# EAGLE design AQETHBluePill_w_RESET (EAGLE 6.5.0)
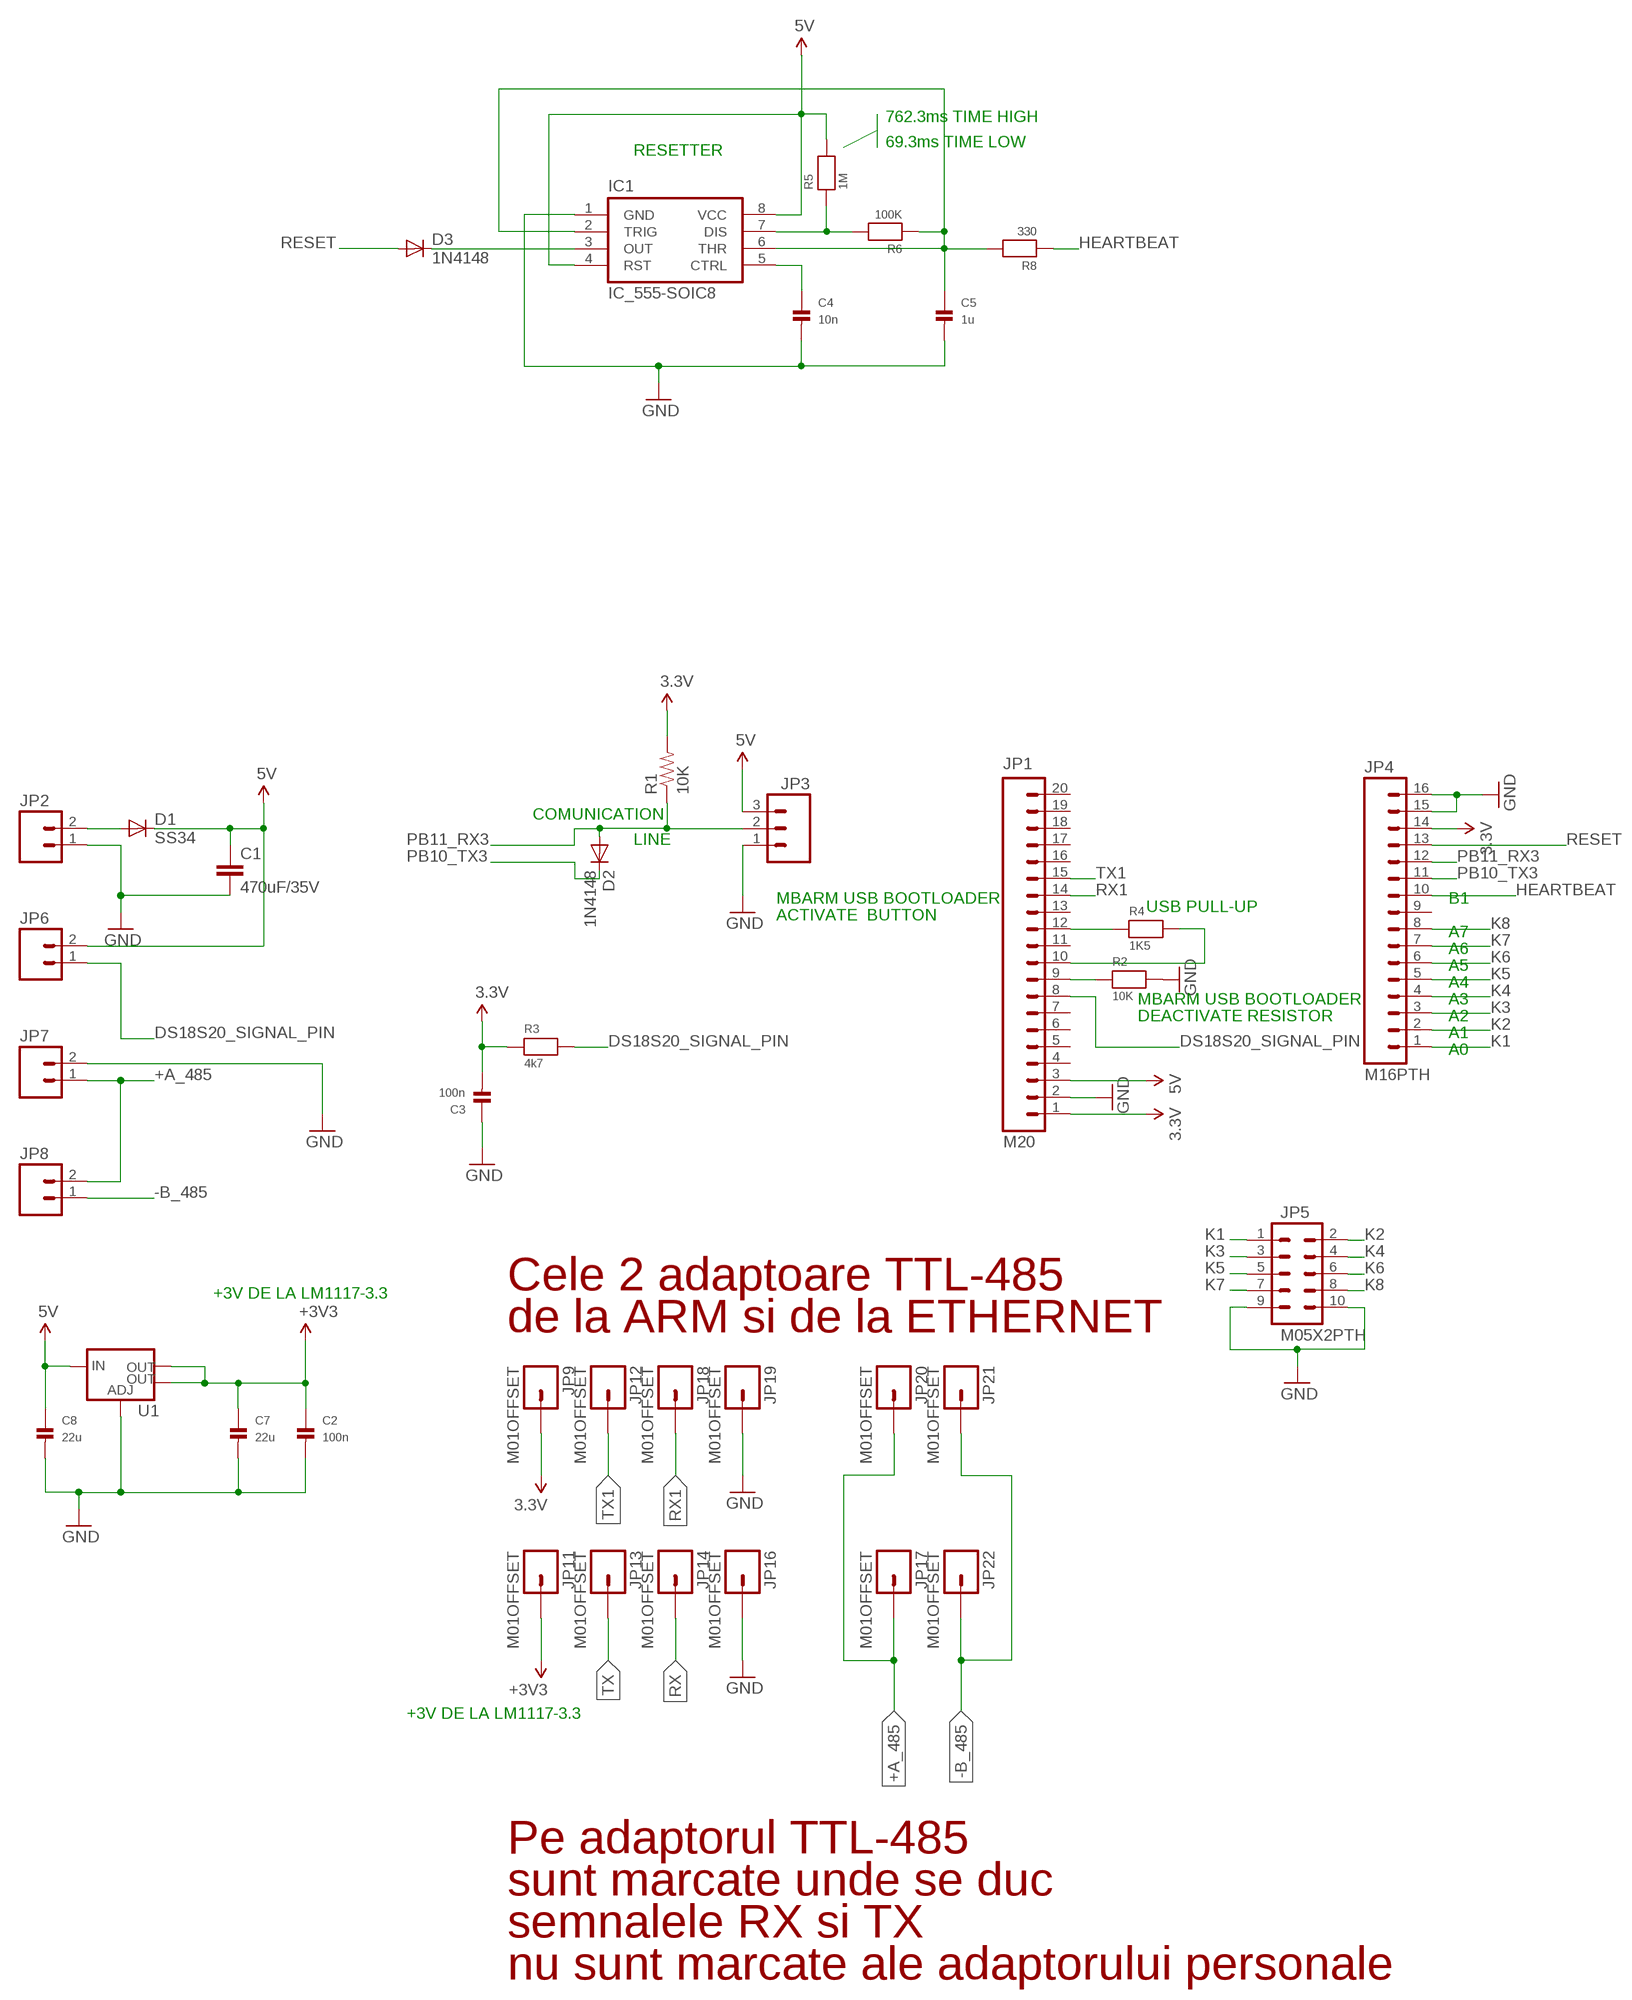
[diagram p0: schematic, sheet 1]

## Parts
C1  470uF/35V  CAPPTH1  [CAP-PTH-5MM]
C2  100n  CAP_CERAMIC_0805MP  [_0805MP]
C3  100n  CAP_CERAMIC_0805MP  [_0805MP]
C4  10n  CAP_CERAMIC_0805MP  [_0805MP]
C5  1u  CAP_CERAMIC1206  [1206]
C7  22u  CAP_CERAMIC1206  [1206]
C8  22u  CAP_CERAMIC1206  [1206]
D1  SS34  DIODE-SMC  [SMC]
D2  1N4148  DIODE-MINIMELF  [MINIMELF]
D3  1N4148  DIODE-MINIMELF  [MINIMELF]
IC1  IC_555-SOIC8  [SOIC-8]
JP1  M20  [1X20]
JP2  M025MM  [SCREWTERMINAL-5MM-2]
JP3  M03LOCK_LONGPADS  [1X03_LOCK_LONGPADS]
JP4  M16PTH  [1X16]
JP5  M05X2PTH  [AVR_ICSP]
JP6  M025MM  [SCREWTERMINAL-5MM-2]
JP7  M025MM  [SCREWTERMINAL-5MM-2]
JP8  M025MM  [SCREWTERMINAL-5MM-2]
JP9  M01OFFSET  [1X01_OFFSET]
JP11  M01OFFSET  [1X01_OFFSET]
JP12  M01OFFSET  [1X01_OFFSET]
JP13  M01OFFSET  [1X01_OFFSET]
JP14  M01OFFSET  [1X01_OFFSET]
JP16  M01OFFSET  [1X01_OFFSET]
JP17  M01OFFSET  [1X01_OFFSET]
JP18  M01OFFSET  [1X01_OFFSET]
JP19  M01OFFSET  [1X01_OFFSET]
JP20  M01OFFSET  [1X01_OFFSET]
JP21  M01OFFSET  [1X01_OFFSET]
JP22  M01OFFSET  [1X01_OFFSET]
R1  10K  RESISTOR1206  [1206]
R2  10K  RESISTOR_0805MP  [_0805MP]
R3  4k7  RESISTOR_0805MP  [_0805MP]
R4  1K5  RESISTOR_0805MP  [_0805MP]
R5  1M  RESISTOR_0805MP  [_0805MP]
R6  100K  RESISTOR_0805MP  [_0805MP]
R8  330  RESISTOR_0805MP  [_0805MP]
U1  V_REG_LM1117SOT223  [SOT223]

## Nets
3.3V: C3.2 JP1.1 JP4.14 JP9.1 R1.2 R3.1
5V: C1.1 C8.1 D1.C IC1.4(RST) IC1.8(VCC) JP1.3 JP3.3 JP6.2 R5.2 U1.3(IN)
+A_485: JP7.1 JP8.2 JP17.1 JP20.1
-B_485: JP8.1 JP21.1 JP22.1
CTRL: C4.1 IC1.5(CTRL)
DS18S20_SIGNAL_PIN: JP1.8 JP6.1 R3.2
GND: C1.2 C2.2 C3.1 C4.2 C5.2 C7.2 C8.2 IC1.1(GND) JP1.2 JP2.1 JP3.1 JP4.15 JP4.16 JP5.9 JP5.10 JP7.2 JP16.1 JP19.1 R2.2 U1.1(ADJ)
HEARTBEAT: JP4.10 R8.1
K1: JP4.1 JP5.1
K2: JP4.2 JP5.2
K3: JP4.3 JP5.3
K4: JP4.4 JP5.4
K5: JP4.5 JP5.5
K6: JP4.6 JP5.6
K7: JP4.7 JP5.7
K8: JP4.8 JP5.8
N$1: JP1.10 R4.2
N$2: JP1.9 R2.1
N$3: JP1.12 R4.1
N$6: C5.1 IC1.2(TRIG) IC1.6(THR) R6.1 R8.2
N$7: D3.C IC1.3(OUT)
N$8: IC1.7(DIS) R5.1 R6.2
N$12: D1.A JP2.2
PB10_TX3: D2.C JP4.11
PB11_RX3: D2.A JP3.2 JP4.12 R1.1
RESET: D3.A JP4.13
RX: JP14.1
RX1: JP1.14 JP18.1
TX: JP13.1
TX1: JP1.15 JP12.1
VCC: C2.1 C7.1 JP11.1 U1.2(OUT) U1.4(OUT) ; supply symbol labelled +3V3
Unconnected: JP1.4 JP1.5 JP1.6 JP1.7 JP1.11 JP1.13 JP1.16 JP1.17 JP1.18 JP1.19 JP1.20 JP4.9

## Notes on the sheet
- 762.3ms TIME HIGH
- 69.3ms TIME LOW
- RESETTER
- COMUNICATION
- LINE
- MBARM USB BOOTLOADER | B1
- USB PULL-UP
- ACTIVATE  BUTTON
- A7
- A6
- A5
- A4
- MBARM USB BOOTLOADER | A3
- DEACTIVATE RESISTOR | A2
- A1
- A0
- Cele 2 adaptoare TTL-485
- +3V DE LA LM1117-3.3
- de la ARM si de la ETHERNET
- +3V DE LA LM1117-3.3
- Pe adaptorul TTL-485
- sunt marcate unde se duc
- semnalele RX si TX
- nu sunt marcate ale adaptorului personale

## Library data of the parts
C1 = SparkFun-Passives:CAP: Capacitor Standard 0603 ceramic capacitor, and 0.1" leaded capacitor.
C2-C5 C7 C8 = microbuilder:CAP_CERAMIC: Ceramic Capacitors 0402 - 0402 Surface Mount Capacitors 16pF 50V 5% [Digikey: 445-4899-2-ND] 18pF 50V 5% [Digikey: 490-1281-2-ND] 22pF 50V 5% [Digikey: 490-1283-2-ND] 68pF 50V 5% [Digikey: 490-1289-2-ND] 0.1uF 10V 10% [Digikey: 490-1318-2-ND] 1.0uF 6.3V 10% [Digikey: 490-1320-2-ND] 0603 - 0603 Surface Mount Capacitors 16 pF 50V 5% [Digikey: 445-5051-2-ND] 22 pF 50V [Digikey: PCC220ACVTR-ND] 33 pF 50V 5% [Digikey: 490-1415-1-ND] 56pF 50V 5% [Digikey: 490-1421-1-ND] 220pF 50V 5% [Digikey: 445-1285-1-ND] 680 pF 50V 2200 pF 50V 5% C0G [Digikey: 445-1297-1-ND] 5600 pF 100V 5% X7R [Digikey: 478-3711-1-ND] 0.1 µF 25V 10% [Digikey: PCC2277TR-ND] 0.22 µF 16V 10% X7R [Digikey: 445-1318-1-ND] 1.0 µF 25V 10% [Digikey: 445-5146-2-ND] 0603 - RF Specific 3pF 250V +/-0.1pF RF [Digikey: 712-1347-1-ND] 18 pF 250V 5% [Digikey: 478-3505-1-ND or 712-1322-1-ND] 56 pF 250V 5% C0G RF [Digikey: 490-4867-1-ND] 68 pF 250V RF [Digikey: 490-4868-1-ND] 0805 - 0805 Surface Mount Capacitors 220 pF 250V 2% RF Ceramic Capacitor [Digikey: 712-1398-1-ND] 1000 pF 50V 2% NP0 Ceramic Capacitor [Digikey: 478-3760-1-ND] 0.1 µF 25V 10% Ceramic Capacitor [Digikey: PCC1828TR-ND] 1.0 µF 16V 10% Ceramic Capacitor[Digikey: 490-1691-2-ND] 10.0 µF 10V 10% Ceramic Capacitor[Digikey: 709-1228-1-ND] 10.0 uF 16V 10% Ceramic Capacitor [Digikey: 478-5165-2-ND] 47 uF 6.3V 20% Ceramic Capacitor [Digikey: 587-1779-1-ND or 399-5506-1-ND] 1206 - 1206 Surface Mount Capacitors 47uF 10V 20% Ceramic Capacitor [Digikey: 490-5528-1-ND or 399-5508-1-ND or 445-6010-1-ND] 100uF 6.3V -20%, +80% Y5V Ceramic Capacitor (Digikey: 490-4512-1-ND, Mouser: 81-GRM31CF50J107ZE1L)
D1-D3 = diode:DIODE-: DIODE
IC1 = dp_devices:IC_555: Classic 555 IC
JP1 = SparkFun-Connectors:M20: 1x20 .1" header This is just like the LOCK variant in that the holes are staggared by 5 mil, but except for the last two holes. They are not altered from the "standard" footprint layout. This is used for a special purpose on the layout of our Graphic LCD Backpack. Make sure you want to use this device before selecting it for you project!
JP2 JP6-JP8 = SparkFun-Connectors:M02: Header 2 Standard 2-pin 0.1" header. Use with straight break away headers (SKU : PRT-00116), right angle break away headers (PRT-00553), swiss pins (PRT-00743), machine pins (PRT-00117), and female headers (PRT-00115). Molex polarized connector foot print use with SKU : PRT-08233 with associated crimp pins and housings.
JP3 = SparkFun-Connectors:M03: Header 3 Standard 3-pin 0.1" header. Use with straight break away headers (SKU : PRT-00116), right angle break away headers (PRT-00553), swiss pins (PRT-00743), machine pins (PRT-00117), and female headers (PRT-00115). Molex polarized connector foot print use with SKU : PRT-08232 with associated crimp pins and housings.
JP4 = SparkFun-Connectors:M16: 1x16 .1" header
JP5 = SparkFun-Connectors:M05X2: Header 5x2 Standard 10-pin dual row 0.1" header. Commonly used with AVR-ISP. Use with Spark Fun Electronics SKU: PRT-00778
JP9 JP11-JP14 JP16-JP22 = SparkFun-Connectors:M01: Header 1 Standard 1-pin 0.1" header. Use with straight break away headers (SKU : PRT-00116), right angle break away headers (PRT-00553), swiss pins (PRT-00743), machine pins (PRT-00117), and female headers (PRT-00115).
R1 = SparkFun-Passives:RESISTOR: Resistor Basic schematic elements and footprints for 0603, 1206, and PTH resistors.
R2-R6 R8 = microbuilder:RESISTOR: Resistors 0402 - 0402 Surface Mount Package 22 Ohm 1% 1/16W [Digikey: 311-22.0LRTR-ND] 33 Ohm 5% 1/16W 1.0K 5% 1/16W 1.5K 5% 1/16W 2.0K 1% 1/16W 10.0K 1% 1/16W [Digikey: 311-10.0KLRTR-ND] 10.0K 5% 1/16W [Digikey: RMCF0402JT10K0TR-ND] 12.1K 1% 1/16W [Digikey: 311-22.0LRTR-ND] 100.0K 5% 1/16W 0603 - 0603 Surface Mount Package 0 Ohm 1/10 Watt 1% Resistor 15 Ohm 1/10 Watt 1% Resistor 33 Ohm 1/10 Watt 1% Resistor 49.9 Ohm 1/10 Watt 1% Resistor 100 Ohm 1/10 Watt 1% Resistor 150 Ohm 1/10 Watt 1% Resistor 240 Ohm 1/10 Watt 1% Resistor 390 Ohm 1/10 Watt 1% Resistor 560 Ohm 1/10 Watt 1% Resistor 680 Ohm 1/10 Watt 1% Resistor 750 Ohm 1/10 Watt 1% Resistor 1.0K Ohm 1/10 Watt 1% Resistor 1.5K Ohm 1/10 Watt 1% Resistor 2.0K Ohm 1/10 Watt 1% Resistor 2.2K Ohm 1/10 Watt 1% Resistor 3.3K Ohm 1/10 Watt 1% Resistor 4.7K Ohm 1/10 Watt 1% Resistor 10.0K Ohm 1/10 Watt 1% Resistor 12.0K Ohm 1/10 Watt 1% Resistor 12.1K Ohm 1/10 Watt 1% Resistor 20.0K Ohm 1/10 Watt 1% Resistor 33.0K Ohm 1/10 Watt 1% Resistor 100.0K Ohm 1/10 Watt 1% Resistor 0805 - 0805 Surface Mount Package 0 Ohm 1/8 Watt 1% Resistor 33 Ohm 1/8 Watt 1% Resistor 100 Ohm 1/8 Watt 1% Resistor 150 Ohm 1/8 Watt 1% Resistor 200 Ohm 1/8 Watt 1% Resistor 240 Ohm 1/8 Watt 1% Resistor 330 Ohm 1/8 Watt 1% Resistor 390 Ohm 1/8 Watt 1% Resistor 470 Ohm 1/8 Watt 1% Resistor 1.0K Ohm 1/8 Watt 1% Resistor 1.5K Ohm 1/8 Watt 1% Resistor 2.0K Ohm 1/8 Watt 1% Resistor 4.7K Ohm 1/8 Watt 1% Resistor 5.1K Ohm 1/8 Watt 1% Resistor 5.6K Ohm 1/8 Watt 1% Resistor 10.0K Ohm 1/8 Watt 1% Resistor 22.0K Ohm 1/8 Watt 1% Resistor 33.0K Ohm 1/8 Watt 1% Resistor 100K Ohm 1/8 Watt 1% Resistor 1206 - 1206 Surface Mount Package 2012 - 2010 Surface Mount Package 0.11 Ohm 1/2 Watt 1% Resistor - Digikey: RHM.11UCT-ND
U1 = SparkFun-PowerIC:V_REG_LM1117: Voltage Regulator LM1117 Standard adjustable voltage regulator but in SMD form. Spark Fun Electronics SKU : COM-00595; PROD_ID: VREG-08170

## Board
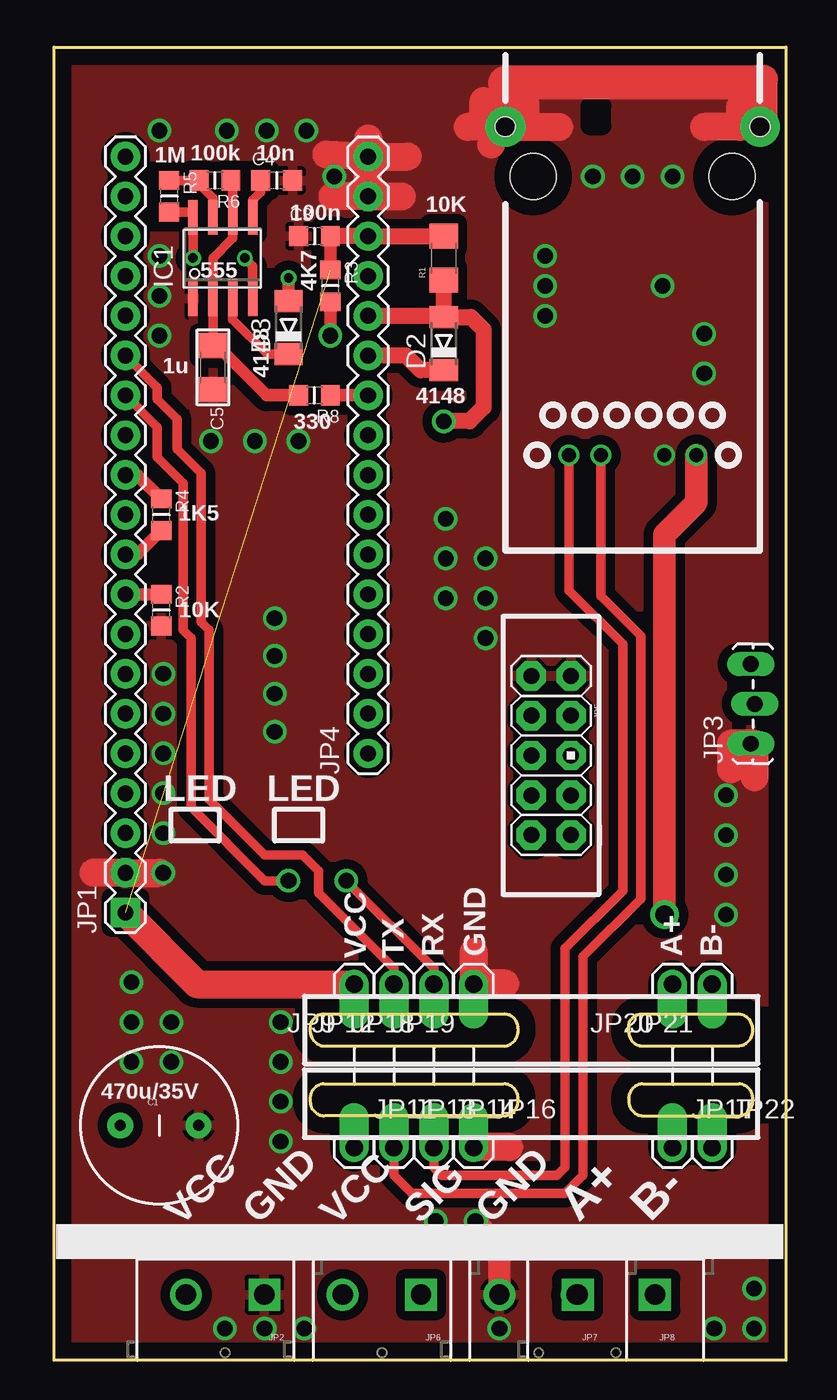
[diagram p1: board, top side]
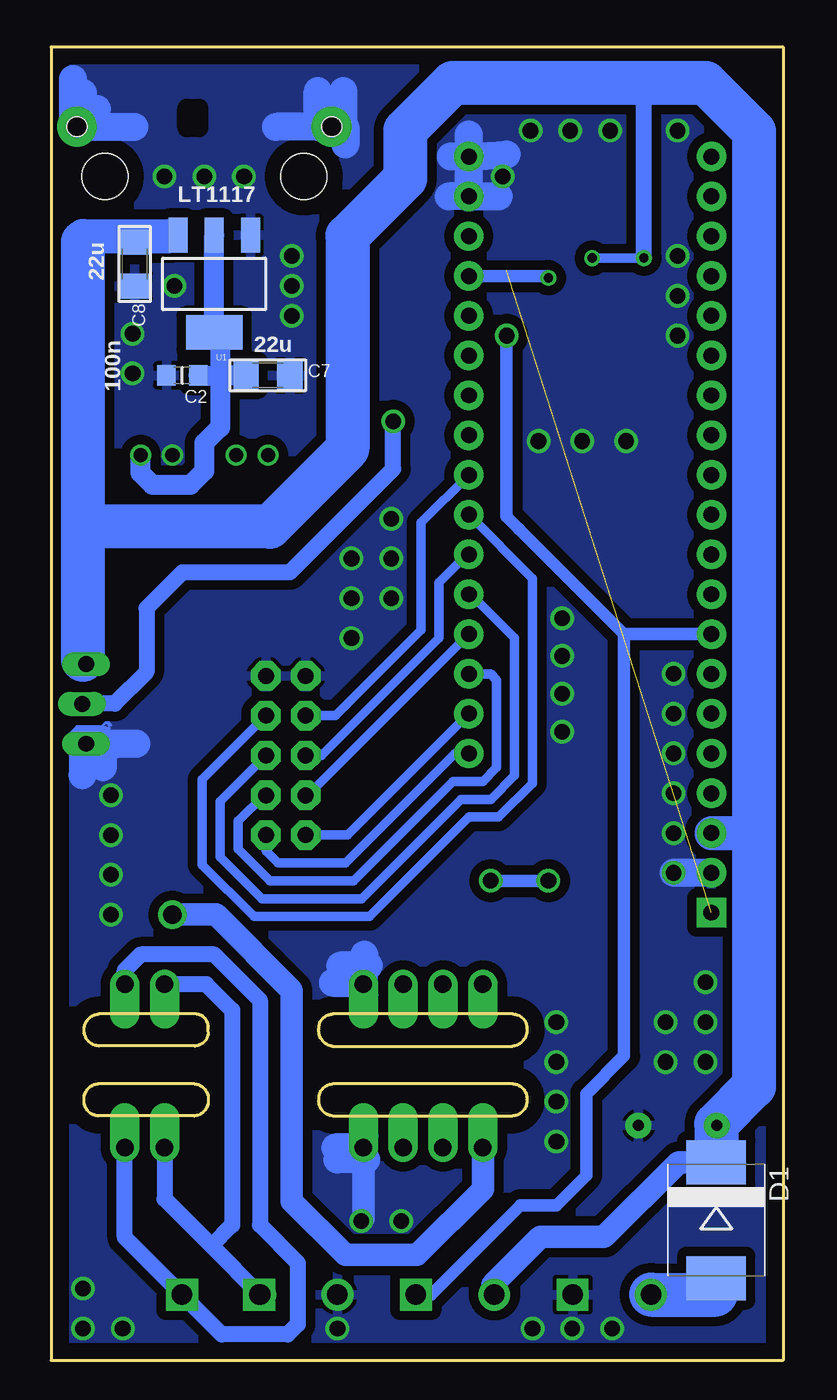
[diagram p2: board, bottom side, seen from below]

Size 46.74 x 83.82 mm. Coordinates in mm from the lower left corner, seen from the top.
Outline: 37.59,15.6 43.74,15.6 arc90 44.63,16.64 arc90 43.74,17.65 37.59,17.65 arc90 36.7,16.64 arc90 37.62,15.6
Outline: 46.74,83.82 46.74,0 0,0 0,83.82 46.74,83.82
Outline: 17.25,17.65 28.75,17.65 arc-90 29.64,16.64 arc-90 28.75,15.6 17.27,15.6 arc-90 16.36,16.64 arc-90 17.25,17.65
Outline: 37.47,22.1 43.69,22.1 arc-90 44.63,21.08 arc-90 43.69,20.07 37.59,20.07 arc-90 36.7,20.95 36.7,21.21 arc-90 37.47,22.1
Outline: 17.25,22.1 28.75,22.1 arc-90 29.64,21.21 arc-90 28.75,20.04 17.27,20.04 arc-90 16.36,21.21 arc-90 17.25,22.1
Copper layers (1*16): Top 0.035mm / dielectric 1.5mm / Bottom 0.035mm
Design rules "default *": minimum track width 10mil, minimum drill 24mil, track to track 8mil, track to pad 8mil, pad to pad 8mil, via to via 8mil, smd to smd 8mil, copper to edge 40mil, drill to drill 8mil, minimum pad ring 10mil, minimum via ring 8mil, stop-mask expansion 4mil, vias tented up to drill 24mil, thermal gap 10mil
Holes 1.27 mm at 45.09,78.74 28.83,78.74
Holes 2.92 mm at 30.61,75.56 43.31,75.56
tRestrict: area 34.2,78.8 to 35,80.1
bRestrict: area 37.3,78.7 to 38.1,79.9

### Footprints (pad centres in the part's own frame; a part is rotated, then mirrored left to right if it is on the bottom)
CAP-PTH-5MM = drill 0.7 pad 1.651: 1 -2.5,0; 2 2.5,0
_0805MP = smd 1.2 x 1.3: 1 -1.016,0; 2 1.016,0
1206 = smd 1.6 x 1.8: 1 -1.4,0; 2 1.4,0
SMC = smd 2.8 x 3.8: A 3.7,0; C -3.7,0
MINIMELF = smd 1.4 x 1.8: A 1.7,0; C -1.7,0
SOIC-8 = smd 0.6 x 2.2: 1 -1.905,-2.6; 2 -0.635,-2.6; 3 0.635,-2.6; 4 1.905,-2.6; 5 1.905,2.6; 6 0.635,2.6; 7 -0.635,2.6; 8 -1.905,2.6
1X20 = drill 1.016 pad 1.88 square: 1 0,0 | drill 1.016 pad 1.88: 2 2.54,0; 3 5.08,0; 4 7.62,0; 5 10.16,0; 6 12.7,0; 7 15.24,0; 8 17.78,0; 9 20.32,0; 10 22.86,0; 11 25.4,0; 12 27.94,0; 13 30.48,0; 14 33.02,0; 15 35.56,0; 16 38.1,0; 17 40.64,0; 18 43.18,0; 19 45.72,0; 20 48.26,0
SCREWTERMINAL-5MM-2 = drill 1.3 pad 2.032 square: 1 0,0 | drill 1.3 pad 2.032: 2 5,0
1X03_LOCK_LONGPADS = drill 1.016 long: 1 0,0; 2 2.54,-0.254; 3 5.08,0
1X16 = drill 1.016 pad 1.88: 1 0,0; 2 2.54,0; 3 5.08,0; 4 7.62,0; 5 10.16,0; 6 12.7,0; 7 15.24,0; 8 17.78,0; 9 20.32,0; 10 22.86,0; 11 25.4,0; 12 27.94,0; 13 30.48,0; 14 33.02,0; 15 35.56,0; 16 38.1,0
AVR_ICSP = drill 1.016 pad 1.88 octagon: 1 -1.27,5.08; 2 1.27,5.08; 3 -1.27,2.54; 4 1.27,2.54; 5 -1.27,0; 6 1.27,0; 7 -1.27,-2.54; 8 1.27,-2.54; 9 -1.27,-5.08; 10 1.27,-5.08
1X01_OFFSET = drill 1.118 pad 1.88 offset: 1 0,0
SOT223 = smd 1.219 x 2.235: 1 -2.311,-3.099; 2 0,-3.099; 3 2.311,-3.099 | smd 3.6 x 2.2: 4 0,3.099

### Placement (x,y rotation side)
C1  6.73,14.99 0 top
C2  38.35,62.87 180 bottom
C3  16.64,71.75 0 top
C4  14.22,75.31 0 top
C5  10.16,63.37 270 top
C7  32.89,62.87 0 bottom
C8  41.4,69.98 270 bottom
D1  4.27,8.94 270 bottom
D2  24.89,64.9 90 top
D3  14.99,65.91 90 top
IC1  10.79,70.36 0 top
JP1  4.57,28.57 90 top
JP2  13.44,4.19 180 top
JP3  44.5,39.36 90 top
JP4  20.07,38.73 90 top
JP5  31.75,38.61 180 top
JP6  23.44,4.19 180 top
JP7  33.45,4.19 180 top
JP8  38.38,4.19 180 top
JP9  19.18,24 180 top
JP11  19.18,13.59 0 top
JP12  21.72,24 180 top
JP13  21.72,13.59 0 top
JP14  24.26,13.59 0 top
JP16  26.8,13.59 0 top
JP17  39.5,13.59 0 top
JP18  24.26,24 180 top
JP19  26.8,24 180 top
JP20  39.5,24 180 top
JP21  42.04,24 180 top
JP22  42.04,13.59 0 top
R1  24.89,70.36 90 top
R2  6.86,47.88 270 top
R3  17.65,68.58 270 top
R4  6.86,53.98 270 top
R5  7.37,74.3 270 top
R6  10.29,75.31 180 top
R8  16.64,61.59 180 top
U1  36.32,68.71 180 bottom

### Tracks (layer width: path | path; a pad name or v marks a point on that pad's centre or on a via)
3.3V  (1 unrouted)
  Top 0.813: C3.2 R3.1
  Top 1.016: R1.2 JP4.14 C3.2
  Top 1.778: JP9.1 9.14,24 JP1.1
5V  (via drill 0.6)
  Top 0.61: IC1.4 12.7,69.85 v12.19,70.36 | R5.2 8.89,73.28 IC1.8 v8.89,70.36
  Bottom 0.61: C8.1 38.63,71.38 U1.3 38.63,71.75 39.12,71.75 | v12.19,70.36 v8.89,70.36
  Bottom 0.813: JP3.3 44.7,44.44 44.7,44.7
  Bottom 1.016: v8.89,70.36 8.89,81.53 8.76,81.53
  Bottom 1.422: JP6.2 18.54,4.29 18.54,4.83 15.49,7.87 11.43,7.87 6.66,12.64 D1.C | C1.1 4.27,14.95 4.27,13.21
  Bottom 2.184: JP1.3 1.86,33.66 1.86,33.53 | 44.7,71.37 44.7,71.75 39.12,71.75
  Bottom 2.794: 44.7,71.37 44.7,53.21 | 44.7,53.21 44.7,44.7 | 44.7,53.21 32.77,53.21 27.81,58.17 27.81,71.75 24.13,75.44 24.13,78.49 21.08,81.53 8.76,81.53 4.95,81.53 1.86,78.44 1.86,33.53 1.86,17.49 4.27,15.08 4.27,13.21 D1.C
+A_485
  Bottom 1.016: JP17.1 39.5,10.31 36.5,7.31 | 36.5,7.31 JP8.2 | JP20.1 36.83,24 35.18,22.35 35.18,8.64 36.5,7.31
  Bottom 1.27: JP7.1 JP8.2
-B_485
  Bottom 1.016: JP21.1 42.04,24.89 41.02,25.91 36.32,25.91 33.4,22.99 33.4,8.64 30.99,6.22 30.99,2.29 31.62,1.65 35.84,1.65 JP8.1 42.04,7.85 JP22.1
CTRL
  Top 0.61: C4.1 13.21,74.55 12.7,74.04 IC1.5
DS18S20_SIGNAL_PIN  (via drill 1)
  Top 0.813: v17.65,65.41 R3.2
  Bottom 0.813: 10.16,46.35 10.16,19.43 12.57,17.02 12.57,11.81 14.48,9.91 16.76,9.91 22.48,4.19 JP6.1 | 10.16,46.35 JP1.8 | 10.16,46.35 16.83,53.02 16.89,53.09 17.65,53.85 v17.65,65.41
GND  (via drill 0.9, 1, 1.3 pad 2.54)
  Top 1.422: v26.92,8.89 28.45,6.98 JP7.2
  Top 1.778: 6.73,31.11 JP1.2 2.54,31.11 | JP4.16 17.4,76.96 | JP4.16 22.61,76.83 | JP4.15 17.78,74.3 | JP4.15 22.23,74.3 | JP4.15 JP4.16 | JP4.16 20.07,77.98 | v28.83,78.74 26.42,78.74 | v28.83,78.74 32.26,78.74 | v45.09,78.74 41.53,78.74 | v28.83,78.74 27.43,78.74 27.43,80.39 | v28.83,78.74 30.1,78.74 30.1,80.26 | v45.09,78.74 43.81,78.74 43.81,80.01 | v45.09,78.74 45.34,78.74 45.34,81.79 | v28.83,78.74 27.94,78.74 27.94,77.6 | 44.73,37.21 44.73,39.37 43.23,39.37 43.23,37.72 | 28.8,24.05 26.77,24.05 | 26.8,26.06 26.8,24.03 | 29.08,13.61 27.05,13.61
  Top 2.184: v45.09,78.74 45.09,81.53 28.83,81.53 v28.83,78.74
  Bottom 0.203: 43,40.34 43.28,40.34 43.36,40.41 43.36,40.36 43.41,40.31 45.06,40.31 | 45.06,40.31 45.39,39.98 45.16,39.98 | 45.16,39.98 44.93,40.21 | 42.9,40.54 43.03,40.54 43.03,40.69 43.28,40.69 43.54,40.44 | 43.56,40.41 43.54,40.44 | 43.54,40.44 45.06,40.44 | 45.74,39.8 45.11,40.44 45.06,40.44 | 45.06,40.44 45.06,40.31 | 45.16,39.98 44.5,39.98 JP3.1
  Bottom 1.422: JP16.1 26.8,9.02 v26.92,8.89
  Bottom 1.778: JP1.2 v6.99,31.11 | JP4.16 21.21,76.83 | JP4.15 21.34,74.3 | JP4.15 18.16,74.3 | JP4.16 17.65,76.96 | JP4.15 JP4.16 | JP4.16 20.07,78.23 | v45.09,78.74 44.7,78.74 44.7,80.9 | v45.09,78.74 41.4,78.74 | v45.09,78.74 43.81,78.74 43.81,79.88 | v45.09,78.74 45.34,78.74 45.34,81.79 | v28.83,78.74 27.94,78.74 27.94,77.6 | v28.83,78.74 32.38,78.74 | v28.83,78.74 28.07,78.74 28.07,81.03 | v28.83,78.74 29.72,78.74 29.72,81.03 | 44.45,39.24 44.73,39.24 44.73,37.34 | 42.7,39.37 41.27,39.37 | 44.37,39.37 43.43,39.37 | 43.43,39.37 43.43,37.85 | 44.58,39.37 JP3.1 | JP3.1 44.37,39.37 | 44.37,39.37 44.37,39.34 44.5,39.34 JP3.1 | 43.43,39.37 42.7,39.37 | 42.7,39.37 42.7,39.29 | 26.77,13.59 28.6,13.59 | 26.62,12.83 28.45,12.83 | 26.44,25.2 28.27,25.2 | 26.75,24.05 26.75,25.88 | 28.75,24.11 26.92,24.11
  other vias: 38.99,57.78 41.53,65.53 24.38,8.89 41.53,62.99 14.48,13.97 14.48,16.51 44.7,2.03 44.7,4.57 42.16,2.03 42.93,30.99 42.93,33.53 42.93,36.07 25.02,53.72 25.02,51.18 25.02,48.64 6.73,65.41 6.73,70.48 13.59,78.49 31.37,70.48 36.96,75.56 6.99,43.81 6.99,41.27 6.99,38.73 6.99,36.2 6.99,33.66 11.05,78.49 6.73,78.49 16.13,78.49 6.73,67.94 31.37,66.67 31.37,68.58 38.86,68.58 34.42,75.56 39.5,75.56 42.93,28.45 28.45,2.03 13.46,2.03 16,2.03 10.92,2.03 4.95,24.13 4.95,21.59 4.95,19.05 7.49,21.59 7.49,19.05 14.48,21.59 14.48,19.05 27.56,51.18 27.56,48.64 27.56,46.1 17.91,75.56 10.03,58.67 12.83,58.67 15.62,58.67 14.1,47.37 14.1,44.96 14.1,42.55 14.1,40.13
  pour Bottom (isolate 0.61): 0,0 46.74,0 46.74,83.82 0,83.82
  pour Top (isolate 0.61): 0,83.82 46.74,83.82 46.74,0 0,0
HEARTBEAT
  Top 0.813: JP4.10 R8.1
K1
  Bottom 0.61: JP4.1 20.95,38.73 27.94,31.75 32.26,31.75 33.02,32.51 JP5.1
K2
  Bottom 0.61: JP5.2 27.81,33.53 JP4.2
K3
  Bottom 0.61: JP4.3 18.67,43.81 18.29,43.43 18.29,37.85 19.18,36.96 21.08,36.96 27.43,30.61 32.77,30.61 34.8,32.64 34.8,34.42 33.15,36.07 JP5.3
K4
  Bottom 0.61: JP4.4 30.35,36.07 JP5.4
K5
  Bottom 0.61: JP4.5 19.94,48.9 17.14,46.1 17.14,37.34 18.67,35.81 20.57,35.81 26.92,29.46 33.27,29.46 35.94,32.13 35.94,35.69 JP5.5
K6
  Bottom 0.61: JP4.6 20.19,51.44 21.97,49.66 21.97,46.1 29.46,38.61 JP5.6
K7
  Bottom 0.61: JP4.7 16,49.91 16,36.83 18.16,34.67 20.07,34.67 26.42,28.32 33.78,28.32 37.08,31.62 37.08,37.08 JP5.7
K8
  Bottom 0.61: JP4.8 23.11,53.47 23.11,46.61 28.57,41.15 JP5.8
N$1
  Top 0.813: R4.2 5.33,51.44 JP1.10
N$2
  Top 0.813: JP1.9 R2.1
N$3
  Top 0.813: R4.1 5.33,56.52 JP1.12
N$6
  Top 0.61: R6.1 11.43,75.31 IC1.6 11.43,71.63 10.16,70.36 IC1.2 C5.1
  Top 0.813: R8.2 13.59,61.59 10.41,64.77 C5.1
N$7
  Top 0.61: IC1.3 11.43,66.42 13.64,64.21 D3.C
N$8
  Top 0.61: R5.1 R6.2 9.27,75.06 10.16,74.17 IC1.7
N$12
  Bottom 2.794: JP2.2 4.3,4.19 D1.A
PB10_TX3
  Top 1.016: D2.C 23.42,63.2 22.48,64.14 JP4.11
PB11_RX3  (via drill 1)
  Top 1.016: JP4.12 24.81,66.67 D2.A | R1.1 D2.A | D2.A 26.62,66.6 27.43,65.79 27.43,60.83 26.54,59.94 v24.89,59.94
  Bottom 1.016: v24.89,59.94 24.89,56.9 31.5,50.29 38.35,50.29 40.64,48.01 40.64,43.94 42.67,41.91 JP3.2
RESET  (via drill 0.6)
  Top 0.813: v14.99,69.09 D3.A
  Bottom 0.61: 14.99,69.22 v14.99,69.09
  Bottom 0.813: JP4.13 14.99,69.22
RX  (via drill 0.9)
  Top 0.61: v32.89,57.78 32.89,49.15 36.32,45.72 36.32,29.97 32.64,26.29 32.64,12.32 32.13,11.81 24.77,11.81 24.26,12.32 JP14.1
RX1  (via drill 1)
  Top 0.61: JP18.1 24.26,25.02 v18.67,30.61 | v14.99,30.61 13.46,30.61 8.76,35.31 8.76,46.1 8.26,46.61 8.26,56.01 6.6,57.66 6.6,59.56 JP1.14
  Bottom 0.813: v18.67,30.61 v14.99,30.61
TX  (via drill 0.9)
  Top 0.61: v34.92,57.78 34.92,48.77 37.47,46.23 37.47,29.46 33.78,25.78 33.78,11.81 32.64,10.67 22.86,10.67 21.72,11.81 JP13.1
TX1
  Top 0.61: JP12.1 21.72,25.02 16.89,29.84 16.89,31.24 15.88,32.26 13.46,32.26 9.91,35.81 9.91,46.61 9.4,47.12 9.4,56.64 7.87,58.17 7.87,60.07 6.6,61.34 6.6,62.1 JP1.15
VCC  (via drill 0.9, 1.2)
  Top 1.422: v41.02,57.78 41.02,54.74 38.99,52.7 v38.99,28.45
  Bottom 1.27: U1.2 U1.4 35.94,65.61 35.94,62.87 | v41.02,57.78 41.02,56.64 40.26,55.88 37.85,55.88 36.96,56.77 36.96,58.55 35.94,59.56 35.94,62.87 | C7.1 35.94,62.87 | C2.1 35.94,62.87
  Bottom 1.422: JP11.1 19.18,10.92 23.37,6.73 27.94,6.73 31.37,10.16 31.37,23.62 36.2,28.45 v38.99,28.45

### Text on the board
tPlace: 100k | 10n | 1M | 100n | 10K | 555 | 4K7 | 1u | 4148 | 4148 | 330 | 1K5 | 10K | LED | LED | VCC | TX | RX | GND | A+ | B- | 470u/35V | VCC | GND | VCC | SIG | GND | A+ | B-
bPlace: LT1117 | 22u | 22u | 100n